# Altium schematic sheet INC_ENC_IF.SchDoc
size 420 x 297 mm; SheetNumber: 5; PageSetup: Record=PageOptions|CenterHorizontal=False|CenterVertical=False|PrintScale=0.95|XCorrection=0.00|YCorrection=0.00|PrintKind=1|BorderSize=5000000|LeftOffset=0|BottomOffset=0|Orientation=1|PaperLength=1000|PaperWidth=1000|Scale=100|PaperSource=15|PrintQuality=600|MediaType=1|DitherType=10|PaperKind=A4|PrintScaleMode=1
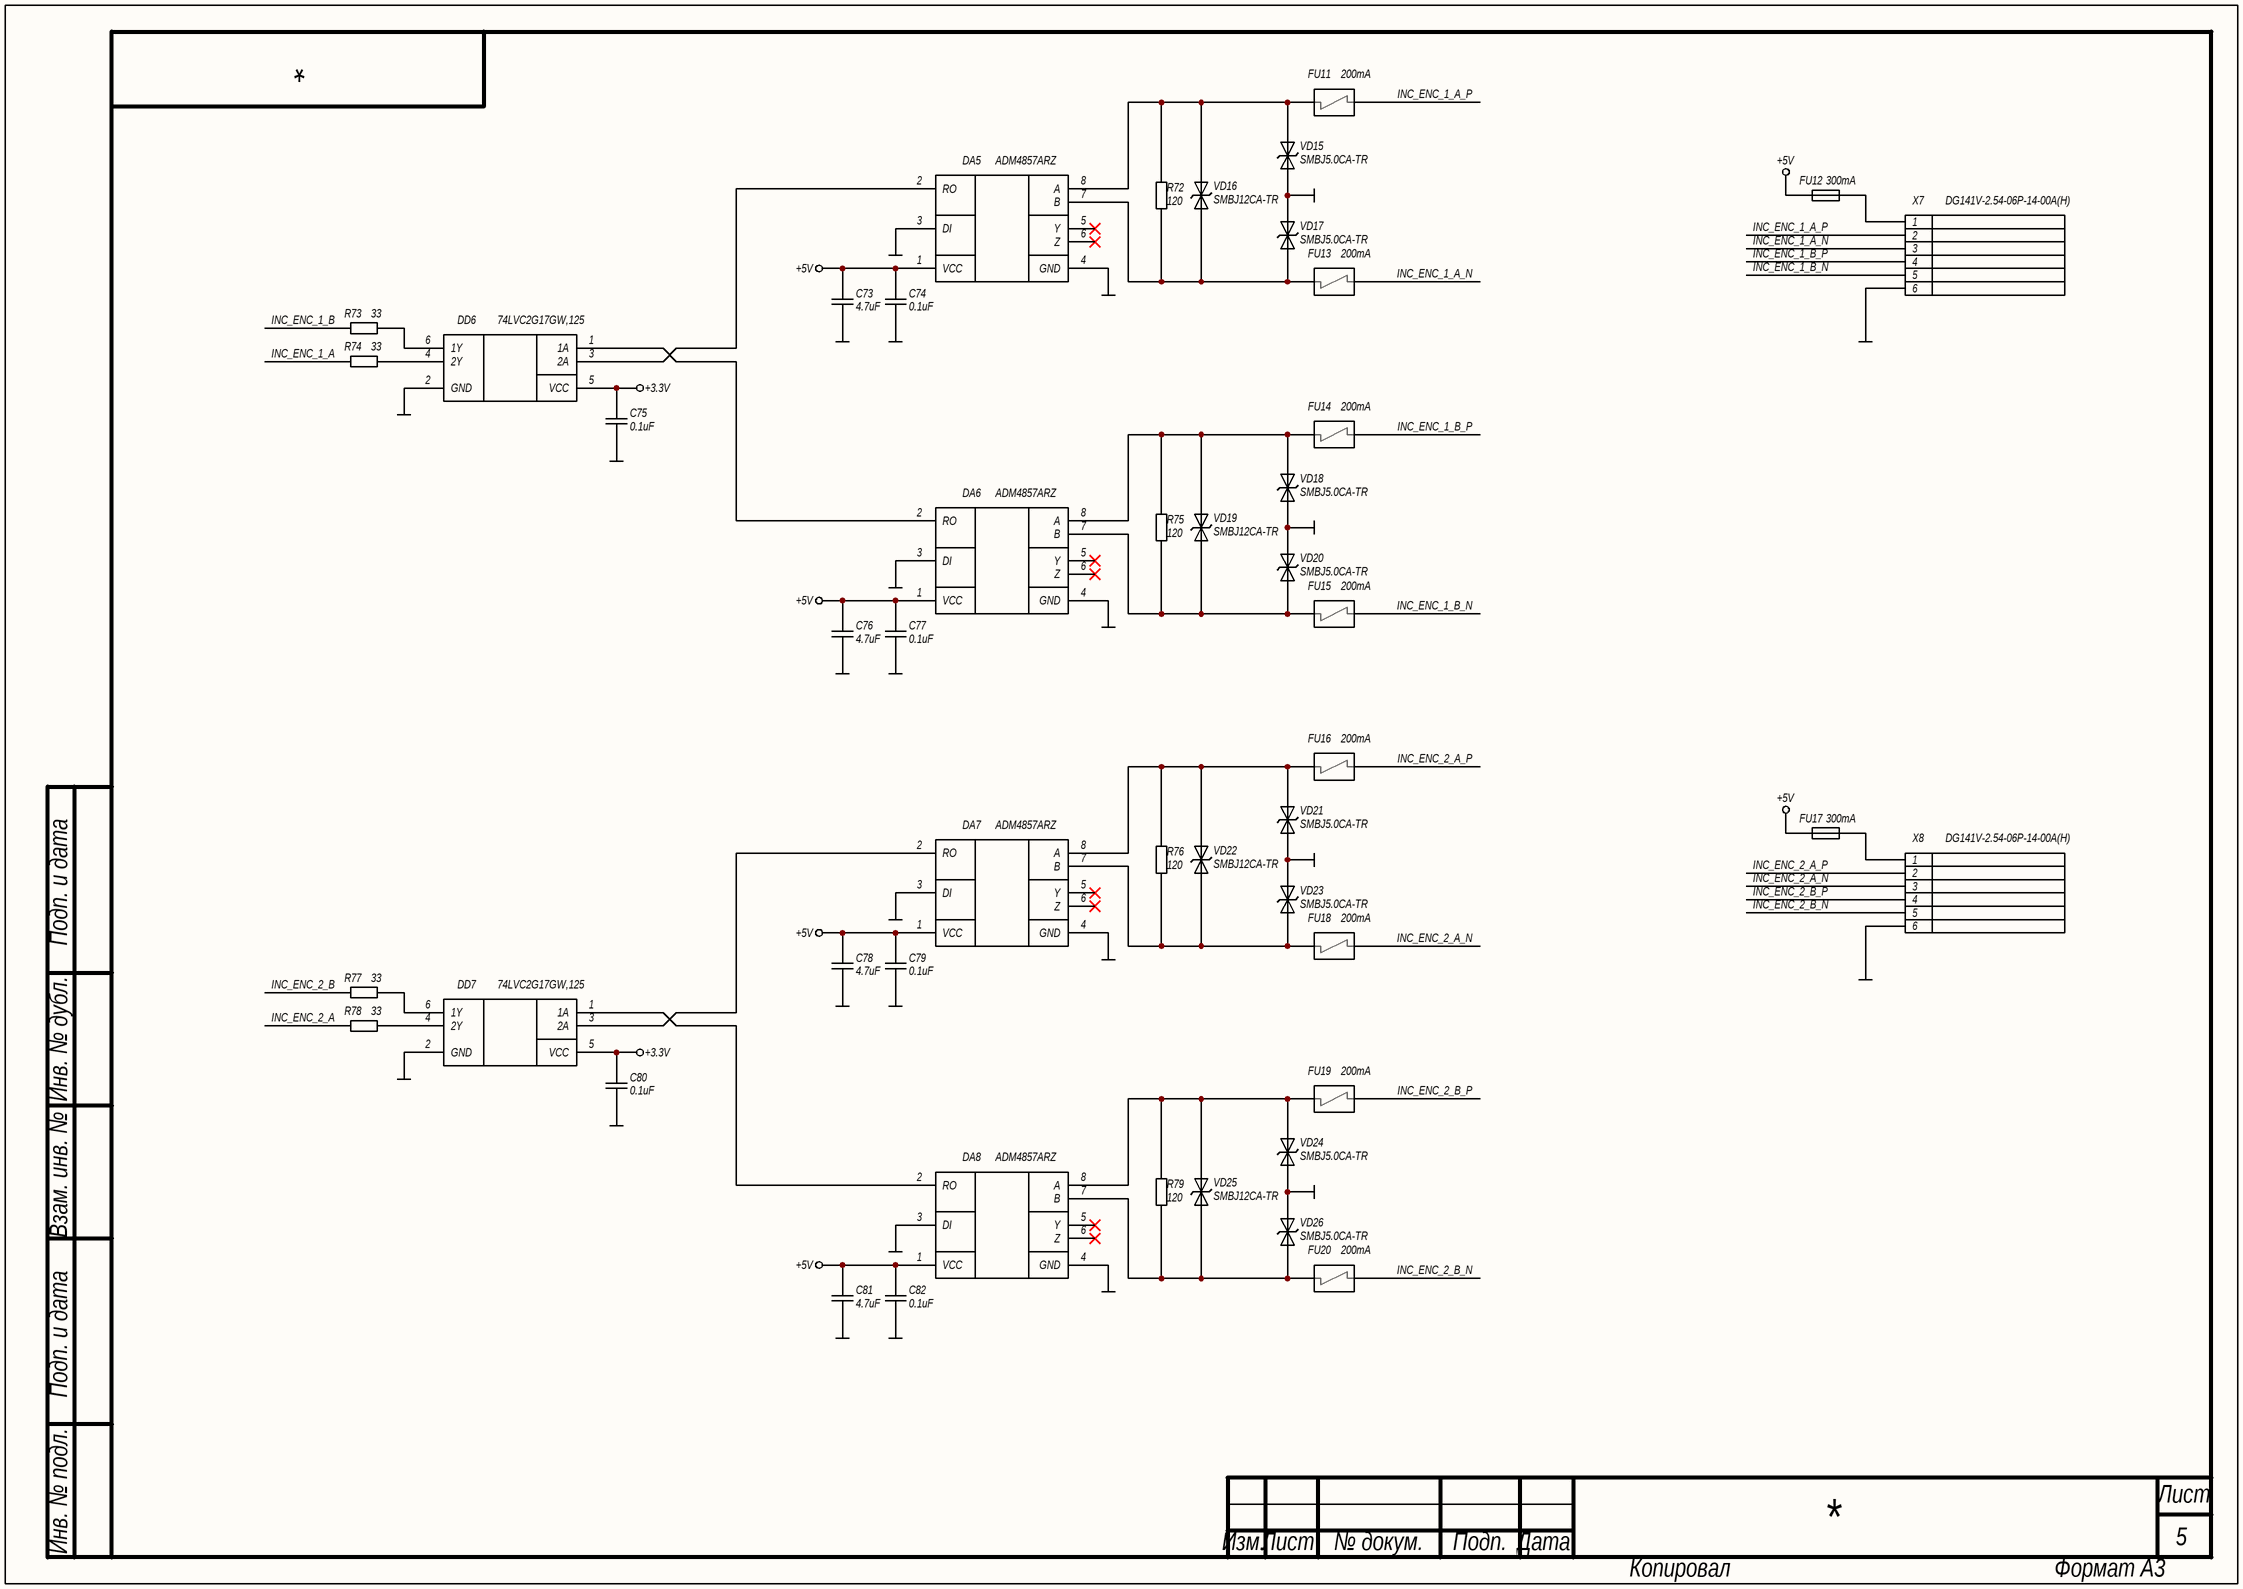
[diagram p0: INC_ENC_IF.SchDoc]

## Parts
C73  4.7uF  [C0603N]
C74  0.1uF  [C0603N]
C75  0.1uF  [C0603N]
C76  4.7uF  [C0603N]
C77  0.1uF  [C0603N]
C78  4.7uF  [C0603N]
C79  0.1uF  [C0603N]
C80  0.1uF  [C0603N]
C81  4.7uF  [C0603N]
C82  0.1uF  [C0603N]
DA5  ADM4857ARZ  [SOIC8]
DA6  ADM4857ARZ  [SOIC8]
DA7  ADM4857ARZ  [SOIC8]
DA8  ADM4857ARZ  [SOIC8]
DD6  74LVC2G17GW,125  [SOT363-2]
DD7  74LVC2G17GW,125  [SOT363-2]
FU11  200mA  [TBU-CA]
FU12  300mA  [MF-MSMF]
FU13  200mA  [TBU-CA]
FU14  200mA  [TBU-CA]
FU15  200mA  [TBU-CA]
FU16  200mA  [TBU-CA]
FU17  300mA  [MF-MSMF]
FU18  200mA  [TBU-CA]
FU19  200mA  [TBU-CA]
FU20  200mA  [TBU-CA]
R72  120  [R0805N]
R73  33  [R0603N]
R74  33  [R0603N]
R75  120  [R0805N]
R76  120  [R0805N]
R77  33  [R0603N]
R78  33  [R0603N]
R79  120  [R0805N]
VD15  SMBJ5.0CA-TR  [SMB]
VD16  SMBJ12CA-TR  [SMB]
VD17  SMBJ5.0CA-TR  [SMB]
VD18  SMBJ5.0CA-TR  [SMB]
VD19  SMBJ12CA-TR  [SMB]
VD20  SMBJ5.0CA-TR  [SMB]
VD21  SMBJ5.0CA-TR  [SMB]
VD22  SMBJ12CA-TR  [SMB]
VD23  SMBJ5.0CA-TR  [SMB]
VD24  SMBJ5.0CA-TR  [SMB]
VD25  SMBJ12CA-TR  [SMB]
VD26  SMBJ5.0CA-TR  [SMB]
X7  DG141V-2.54-06P-14-00A(H)  [DG141V-2.54-06P-14-00A(H)]
X8  DG141V-2.54-06P-14-00A(H)  [DG141V-2.54-06P-14-00A(H)]

## Nets
+3.3V: C75.2 C80.2 DD6.5(VCC) DD7.5(VCC)
+5V: C73.2 C74.2 C76.2 C77.2 C78.2 C79.2 C81.2 C82.2 DA5.1(VCC) DA6.1(VCC) DA7.1(VCC) DA8.1(VCC) FU12.1 FU17.1
GND: C73.1 C74.1 C75.1 C76.1 C77.1 C78.1 C79.1 C80.1 C81.1 C82.1 DA5.3(DI) DA5.4(GND) DA6.3(DI) DA6.4(GND) DA7.3(DI) DA7.4(GND) DA8.3(DI) DA8.4(GND) DD6.2(GND) DD7.2(GND) VD15.2(A2) VD17.2(A2) VD18.2(A2) VD20.2(A2) VD21.2(A2) VD23.2(A2) VD24.2(A2) VD26.2(A2) X7.6 X8.6
INC_ENC_1_A: R74.2
INC_ENC_1_A_N: FU13.3(IN/OUT) X7.3
INC_ENC_1_A_P: FU11.3(IN/OUT) X7.2
INC_ENC_1_B: R73.2
INC_ENC_1_B_N: FU15.3(IN/OUT) X7.5
INC_ENC_1_B_P: FU14.3(IN/OUT) X7.4
INC_ENC_2_A: R78.2
INC_ENC_2_A_N: FU18.3(IN/OUT) X8.3
INC_ENC_2_A_P: FU16.3(IN/OUT) X8.2
INC_ENC_2_B: R77.2
INC_ENC_2_B_N: FU20.3(IN/OUT) X8.5
INC_ENC_2_B_P: FU19.3(IN/OUT) X8.4
NetDA5_2: DA5.2(RO) DD6.3(2A)
NetDA5_7: DA5.7(B) FU13.1(IN/OUT) R72.2 VD16.2(A2) VD17.1(A1)
NetDA5_8: DA5.8(A) FU11.1(IN/OUT) R72.1 VD15.1(A1) VD16.1(A1)
NetDA6_2: DA6.2(RO) DD6.1(1A)
NetDA6_7: DA6.7(B) FU15.1(IN/OUT) R75.2 VD19.2(A2) VD20.1(A1)
NetDA6_8: DA6.8(A) FU14.1(IN/OUT) R75.1 VD18.1(A1) VD19.1(A1)
NetDA7_2: DA7.2(RO) DD7.3(2A)
NetDA7_7: DA7.7(B) FU18.1(IN/OUT) R76.2 VD22.2(A2) VD23.1(A1)
NetDA7_8: DA7.8(A) FU16.1(IN/OUT) R76.1 VD21.1(A1) VD22.1(A1)
NetDA8_2: DA8.2(RO) DD7.1(1A)
NetDA8_7: DA8.7(B) FU20.1(IN/OUT) R79.2 VD25.2(A2) VD26.1(A1)
NetDA8_8: DA8.8(A) FU19.1(IN/OUT) R79.1 VD24.1(A1) VD25.1(A1)
NetDD6_4: DD6.4(2Y) R74.1
NetDD6_6: DD6.6(1Y) R73.1
NetDD7_4: DD7.4(2Y) R78.1
NetDD7_6: DD7.6(1Y) R77.1
NetFU12_2: FU12.2 X7.1
NetFU17_2: FU17.2 X8.1

Not connected (* = marked no-connect by the designer): DA5 5(Y)* 6(Z)*; DA6 5(Y)* 6(Z)*; DA7 5(Y)* 6(Z)*; DA8 5(Y)* 6(Z)*

## Notes on the sheet
- Подп. и дата
- Инв. № дубл.
- Взам. инв. №
- Инв. № подл.
- Лист
- Изм.
- № докум.
- Подп.
- Дата
- Копировал
- Формат А3

## Library data of the parts
C73 C76 C78 C81 = CL10A475KO8NNNC: Конденсатор; Точность: 10%; Напряжение: 16V; Диэлектрик: X5R; Производитель: Samsung Electro-Mechanics; Описание: 4.7 µF ±10% 16V Ceramic Capacitor X5R 0603 (1608 Metric); Корпус: 0603 (1608 Metric); Температурный диапазон: -55°C ~ 85°C; Вид монтажа: SMD; Артикул: CL10A475KO8NNNC; Номинал: 4.7uF; Строка для документации: https://mm.digikey.com/Volume0/opasdata/d220001/medias/docus/2328/CL10A475KO8NNNC_Spec.pdf; Тип элемента: Конденсатор
C74 C75 C77 C79 C80 C82 = CL10B104KB8NNNC: Конденсатор; Точность: 10%; Напряжение: 50V; Диэлектрик: X7R; Производитель: Samsung Electro-Mechanics; Описание: 0.1 µF ±10% 50V Ceramic Capacitor X7R 0603 (1608 Metric); Корпус: 0603 (1608 Metric); Температурный диапазон: -55°C ~ 125°C; Вид монтажа: SMD; Артикул: CL10B104KB8NNNC; Номинал: 0.1uF; Строка для документации: https://mm.digikey.com/Volume0/opasdata/d220001/medias/docus/609/CL10B104KB8NNNC_Spec.pdf; Тип элемента: Конденсатор
DA5-DA8 = ADM4857ARZ: Микросхема интерфейса RS485; Производитель: "D:\Altium\Libraries\GOST_LIBS\Libraries\IC\Analog Devices\ADM4852A.SchLib"; Описание: 1/1 Transceiver Full RS422, RS485 8-SOIC; Корпус: 8-SOIC (0.154", 3.90mm Width); Температурный диапазон: -40°C ~ 85°C; Вид монтажа: SMD; Артикул: ADM4857ARZ; Строка для документации: https://www.analog.com/media/en/technical-documentation/data-sheets/ADM4850_4851_4852_4853_4854_4855_4856_4857.pdf; Тип элемента: Микросхема
DD6 DD7 = 74LVC2G17GW,125: Микросхема сдвоенный триггер Шмитта; Производитель: Nexperia USA Inc.; Описание: Buffer, Non-Inverting 2 Element 1 Bit per Element Push-Pull Output 6-TSSOP; Корпус: 6-TSSOP; Температурный диапазон: -40°C ~ 125°C (TA); Вид монтажа: SMD; Артикул: 74LVC2G17GW,125; Строка для документации: https://assets.nexperia.com/documents/data-sheet/74LVC2G17.pdf; Тип элемента: Микросхема
FU11 FU13-FU16 FU18-FU20 = TBU-CA065-200-WH: Полупроводниковый предохранитель; Напряжение: 650V; Тип: Surge Suppression IС; Производитель: Bourns Inc.; Описание: SURGE SUPP TBU 200MA 650VIMP SMD; Корпус: 6.50mm x 4.00mm; Температурный диапазон: -55°C ~ 125°C; Вид монтажа: SMD; Артикул: TBU-CA065-200-WH; Ток: 200mA; Строка для документации: https://www.bourns.com/docs/Product-Datasheets/TBU-CA.pdf; Тип элемента: Предохранитель
FU12 FU17 = MF-MSMF030-2: Плавкий предохранитель; Напряжение: 30V; Тип: PTC Resettable Fuse; Производитель: Bourns Inc.; Описание: Polymeric PTC Resettable Fuse 30V 300 mA Ih Surface Mount 1812 (4532 Metric), Concave; Корпус: 1812 (4532 Metric), Concave; Температурный диапазон: -40°C ~ 85°C; Вид монтажа: SMD; Артикул: MF-MSMF030-2; Ток: 300mA; Строка для документации: https://www.bourns.com/docs/product-datasheets/mf-msmf.pdf; Тип элемента: Предохранитель
R72 R75 R76 R79 = RC0805FR-07120RL: Резистор; Точность: 1%; ТКС: ±100ppm/°C; Напряжение: 150V; Производитель: YAGEO; Описание: 120 Ohms ±1% 0.125W, 1/8W Chip Resistor 0805 (2012 Metric) Moisture Resistant Thick Film; Корпус: 0805 (2012 Metric); Температурный диапазон: -55°C ~ 155°C; Вид монтажа: SMD; Артикул: RC0805FR-07120RL; Номинал: 120; Строка для документации: https://www.yageo.com/upload/media/product/productsearch/datasheet/rchip/PYu-RC_Group_51_RoHS_L_12.pdf; Тип элемента: Резистор
R73 R74 R77 R78 = RC0603FR-0733RL: Резистор; Точность: 1%; ТКС: ±100ppm/°C; Напряжение: 75V; Производитель: YAGEO; Описание: 33 Ohms ±1% 0.1W, 1/10W Chip Resistor 0603 (1608 Metric) Moisture Resistant Thick Film; Корпус: 0603 (1608 Metric); Температурный диапазон: -55°C ~ 155°C; Вид монтажа: SMD; Артикул: RC0603FR-0733RL; Номинал: 33; Строка для документации: https://www.yageo.com/upload/media/product/app/datasheet/rchip/pyu-rc_group_51_rohs_l.pdf; Тип элемента: Резистор
VD15 VD17 VD18 VD20 VD21 VD23 VD24 VD26 = SMBJ5.0CA-TR: TVS диод двунаправленный; Напряжение: 5V; Напряжение ограничения: 9.2V; Напряжение пробоя: 6.4V; Ток: 68A; Тип: TVS Bidirectional; Производитель: STMicroelectronics; Описание: 9.2V Clamp 68A Ipp Tvs Diode Surface Mount SMB (DO-214AA); Корпус: DO-214AA, SMB; Температурный диапазон: -55°C ~ 150°C (TJ); Вид монтажа: SMD; Тип элемента: Диод защитный; Артикул: SMBJ5.0CA-TR; Строка для документации: https://www.st.com/content/ccc/resource/technical/document/datasheet/19/78/91/39/07/cd/40/65/CD00001366.pdf/files/CD00001366.pdf/_jcr_content/translations/en.CD00001366.pdf
VD16 VD19 VD22 VD25 = SMBJ12CA-TR: TVS диод двунаправленный; Напряжение: 12V; Напряжение ограничения: 19.9V; Напряжение пробоя: 13.3V; Ток: 31A; Тип: TVS Bidirectional; Производитель: STMicroelectronics; Описание: 19.9V Clamp 31A Ipp Tvs Diode Surface Mount SMB (DO-214AA); Корпус: DO-214AA, SMB; Температурный диапазон: -55°C ~ 150°C (TJ); Вид монтажа: SMD; Тип элемента: Диод защитный; Артикул: SMBJ12CA-TR; Строка для документации: https://www.st.com/content/ccc/resource/technical/document/datasheet/19/78/91/39/07/cd/40/65/CD00001366.pdf/files/CD00001366.pdf/_jcr_content/translations/en.CD00001366.pdf
X7 X8 = DG141V-2.54-06P-14-00A(H): Разъем, 6 контактов; Тип разъема: Push-Button terminal block; Количество контактов: 6; Шаг контактов: 2.54mm; Ток: 2A; Напряжение: 150V; Производитель: Degson Electronics; Описание: 6 Position Wire to Board Terminal Block Vertical with Board 0.100" (2.54mm) Through Hole; Температурный диапазон: -40°C ~ 105°C; Вид монтажа: Through Hole; Артикул: DG141V-2.54-06P-14-00A(H); Строка для документации: https://static.chipdip.ru/lib/874/DOC000874680.pdf; Тип элемента: Разъем